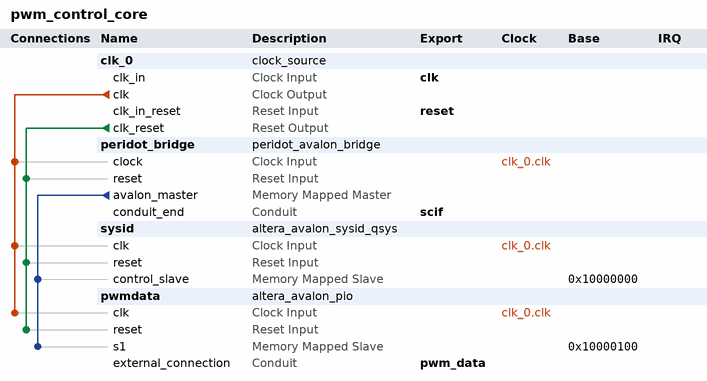
[diagram p0: system contents]
# Platform Designer (Qsys) system pwm_control_core, Cyclone IV E EP4CE6E22C8
# Parameters at their usual value, and those the tool derives, are not listed.
package require -exact qsys 13.1
create_system pwm_control_core
set_project_property DEVICE_FAMILY {Cyclone IV E}
set_project_property DEVICE EP4CE6E22C8

add_instance clk_0 clock_source 13.1
set_instance_parameter_value clk_0 clockFrequency 50000000

add_instance peridot_bridge peridot_avalon_bridge 0.9

add_instance sysid altera_avalon_sysid_qsys 13.1
set_instance_parameter_value sysid id 538120455

add_instance pwmdata altera_avalon_pio 13.1
set_instance_parameter_value pwmdata direction Output
set_instance_parameter_value pwmdata resetValue 128
set_instance_parameter_value pwmdata width 8

# connections
add_connection clk_0.clk peridot_bridge.clock clock
add_connection clk_0.clk pwmdata.clk clock
add_connection clk_0.clk sysid.clk clock
add_connection clk_0.clk_reset peridot_bridge.reset reset
add_connection clk_0.clk_reset pwmdata.reset reset
add_connection clk_0.clk_reset sysid.reset reset
add_connection peridot_bridge.avalon_master pwmdata.s1 avalon
set_connection_parameter_value peridot_bridge.avalon_master/pwmdata.s1 baseAddress 0x10000100
add_connection peridot_bridge.avalon_master sysid.control_slave avalon
set_connection_parameter_value peridot_bridge.avalon_master/sysid.control_slave baseAddress 0x10000000

# exported interfaces
add_interface clk clock sink
set_interface_property clk EXPORT_OF clk_0.clk_in
add_interface reset reset sink
set_interface_property reset EXPORT_OF clk_0.clk_in_reset
add_interface pwm_data conduit end
set_interface_property pwm_data EXPORT_OF pwmdata.external_connection
add_interface scif conduit end
set_interface_property scif EXPORT_OF peridot_bridge.conduit_end

set_interconnect_requirement {$system} qsys_mm.clockCrossingAdapter HANDSHAKE
set_interconnect_requirement {$system} qsys_mm.maxAdditionalLatency 1
set_interconnect_requirement {$system} qsys_mm.insertDefaultSlave false

save_system pwm_control_core.qsys
